# Altium project aptomat.PrjPCB
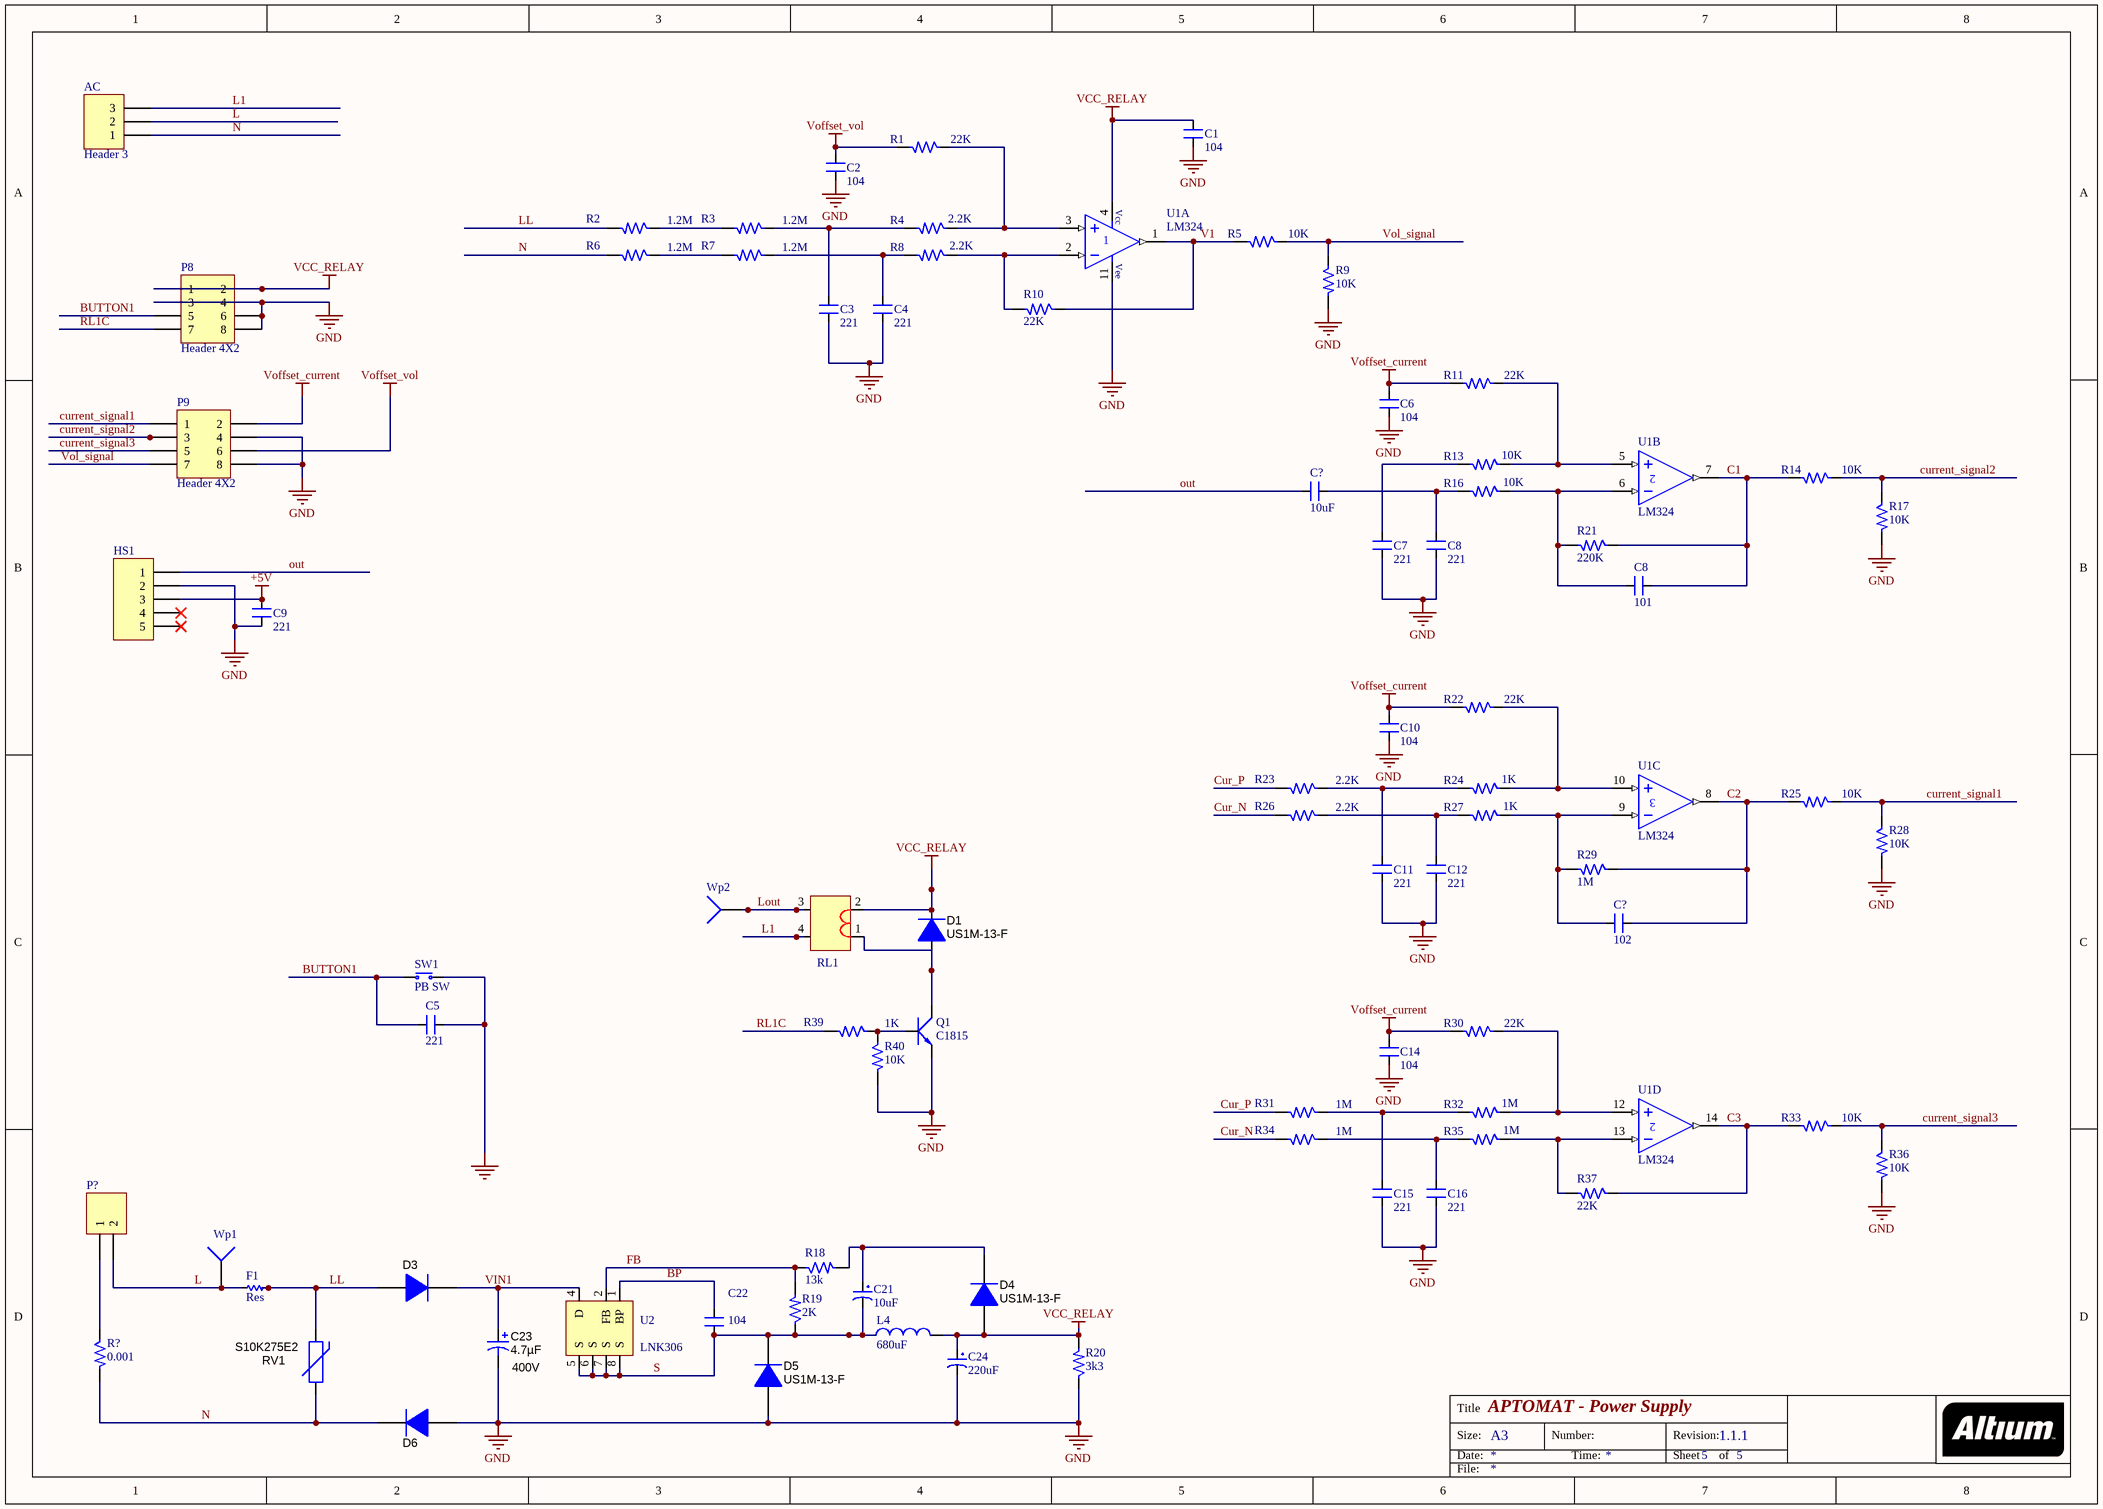
[diagram p0: Aptomat_power_supply.SchDoc]
1 sheet, 80 parts. Net scope: global (net labels, ports and power ports of the same name join across sheets).
Board file: Aptomat_Power.PcbDoc

## Sheet Aptomat_power_supply.SchDoc: APTOMAT - Power Supply
size A3; Revision: 1.1.1; SheetNumber: 5; SheetTotal: 5; DrawnBy: KJP; ProjectNumber: 4397; PCBRevision: 0071KJP; DocumentSize: A4; PCAName: PCA10040; PCBNumber: 400150; ProjectName: Quark

### Parts
(Parts that share a designator on the sheet are numbered #1, #2 ... from top to bottom, then left to right.)
AC  Header 3  [CHAN3DONG]
C1  104  [0805_HV]
C2  104  [0805_HV]
C3  221  [0805_HV]
C4  221  [0805_HV]
C5  221  [0805_HV]
C6  104  [0805_HV]
C7  221  [0805_HV]
C8#1  221  [0805_HV]
C8#2  101  [0805_HV]
C9  221  [0805_HV]
C10  104  [0805_HV]
C11  221  [0805_HV]
C12  221  [0805_HV]
C14  104  [0805_HV]
C15  221  [0805_HV]
C16  221  [0805_HV]
C21  10uF  [TU_NHOM_10uF_MH]
C22  104  [0805_HV]
C23  ValueDisplayed: 4.7µF  Value2: 400V  [PANACAP-G-GENERIC]  (hidden comment: 400AX6R8M8x11)
C24  220uF  [TU_NHOM_2.5_MH]
C?#1  10uF  [0805_HV]
C?#2  102  [0805_HV]
D1  US1M-13-F  [SMB]
D3  US1M-13-F  [SMB]  (value not drawn)
D4  US1M-13-F  [SMB]
D5  US1M-13-F  [SMB]
D6  US1M-13-F  [SMB]  (value not drawn)
F1  Res  [1206]
HS1  Header 5  [HDR1X5]  (value not drawn)
L4  680uF  [Inductor 4.5x5]
P8  Header 4X2  [HDR2X4]
P9  Header 4X2  [HDR2X4]
P?  Header 2  [HDR1X2]  (value not drawn)
Q1  C1815  [SOT23B]
R1  22K  [0805_HV]
R2  1.2M  [1206]
R3  1.2M  [1206]
R4  2.2K  [0805_HV]
R5  10K  [0805_HV]
R6  1.2M  [1206]
R7  1.2M  [1206]
R8  2.2K  [0805_HV]
R9  10K  [0805_HV]
R10  22K  [0805_HV]
R11  22K  [0805_HV]
R13  10K  [0805_HV]
R14  10K  [0805_HV]
R16  10K  [0805_HV]
R17  10K  [0805_HV]
R18  13k  [0805_HV]
R19  2K  [0805_HV]
R20  3k3  [0805_HV]
R21  220K  [0805_HV]
R22  22K  [0805_HV]
R23  2.2K  [0805_HV]
R24  1K  [0805_HV]
R25  10K  [0805_HV]
R26  2.2K  [0805_HV]
R27  1K  [0805_HV]
R28  10K  [0805_HV]
R29  1M  [0805_HV]
R30  22K  [0805_HV]
R31  1M  [0805_HV]
R32  1M  [0805_HV]
R33  10K  [0805_HV]
R34  1M  [0805_HV]
R35  1M  [0805_HV]
R36  10K  [0805_HV]
R37  22K  [0805_HV]
R39  1K  [0805_HV]
R40  10K  [0805_HV]
R?  0.001  [0805_HV]
RL1  Component_1  [RELAY30ASLA12VDC]  (value not drawn)
RV1  S10K275E2  [VAR_S10K275E2]
SW1  PB SW  [Switch-PB-6.2x6.3mm-SMD]
U1  LM324  [D014_L]  (parts A,B,C,D of 4)
U2  LNK306  [SOP 7]
Wp1  Socket  [PIN1]  (value not drawn)
Wp2  Socket  [PIN1]  (value not drawn)

### Nets
+5V: C9.2 HS1.3
GND: C1.1 C2.1 C3.1 C4.1 C5.1 C6.1 C7.1 C8#1.1 C9.1 C10.1 C11.1 C12.1 C14.1 C15.1 C16.1 C23.2(-) C24.2 D5.2(A) D6.2(A) HS1.2 P8.3 P8.4 P8.6 P8.8 P9.4 P9.8 Q1.3(E) R9.2 R17.2 R20.1 R28.2 R36.2 R40.2 SW1.1(N.O) U1.11(V-)
VCC_RELAY: C1.2 C24.1 D1.1(K) D4.2(A) L4.2 P8.1 P8.2 R20.2 RL1.2 U1.4(V+)
Voffset_current: C6.2 C10.2 C14.2 P9.2 R11.2 R22.2 R30.2
Voffset_vol: C2.2 P9.6 R1.2
BP: C22.2 U2.1(BP)
BUTTON1: C5.2 P8.5 SW1.2(COM)
C1: C8#2.1 R14.2 R21.1 U1.7(OUT)
C2: C?#2.1 R25.2 R29.1 U1.8(OUT)
C3: R33.2 R37.1 U1.14(OUT)
Cur_N: R26.2 R34.2
Cur_P: R23.2 R31.2
current_signal1: P9.1 R25.1 R28.1
current_signal2: P9.3 R14.1 R17.1
current_signal3: P9.5 R33.1 R36.1
FB: R18.1 R19.2 U2.2(FB)
L: AC.2 F1.2 P?.2 Wp1.1
L1: AC.3 RL1.4
LL: D3.2(A) F1.1 R2.2 RV1.2
Lout: RL1.3 Wp2.1
N: AC.1 D6.1(K) R6.2 R?.2 RV1.1
out: C?#1.2 HS1.1
RL1C: P8.7 R39.2
S: C21.2 C22.1 D5.1(K) L4.1 R19.1 U2.5(S) U2.6(S) U2.7(S) U2.8(S)
V1: R5.2 R10.1 U1.1(OUT)
VIN1: C23.1(+) D3.1(K) U2.4(D)
Vol_signal: P9.7 R5.1 R9.1
NetC3_2: C3.2 R3.1 R4.2
NetC4_2: C4.2 R7.1 R8.2
NetC7_2: C7.2 R13.2
NetC8#1_2: C8#1.2 C?#1.1 R16.2
NetC8#2_2: C8#2.2 R16.1 R21.2 U1.6(IN-)
NetC11_2: C11.2 R23.1 R24.2
NetC12_2: C12.2 R26.1 R27.2
NetC15_2: C15.2 R31.1 R32.2
NetC16_2: C16.2 R34.1 R35.2
NetC21_1: C21.1 D4.1(K) R18.2
NetC?#2_2: C?#2.2 R27.1 R29.2 U1.9(IN-)
NetD1_2: D1.2(A) Q1.2(C) RL1.1
NetP?_1: P?.1 R?.1
NetQ1_1: Q1.1(B) R39.1 R40.1
NetR1_1: R1.1 R4.1 U1.3(IN+)
NetR2_1: R2.1 R3.2
NetR6_1: R6.1 R7.2
NetR8_1: R8.1 R10.2 U1.2(IN-)
NetR11_1: R11.1 R13.1 U1.5(IN+)
NetR22_1: R22.1 R24.1 U1.10(IN+)
NetR30_1: R30.1 R32.1 U1.12(IN+)
NetR35_1: R35.1 R37.2 U1.13(IN-)

Not connected (* = marked no-connect by the designer): HS1 4* 5*

### Notes on the sheet
- Title
- Size:
- Date:
- A3
- Number:
- Time:
- Revision:
- Sheet
- of
- File:
- (in symbol LM324_MH, part A) Vcc; Vee

### Library data of the parts
AC = Header 3: Header, 3-Pin; LatestRevisionDate: 17-Jul-2002; LatestRevisionNote: Re-released for DXP Platform.; Publisher: Altium Limited
C1-C7 C8#1 C8#2 C9-C12 C14-C16 C22 C?#1 C?#2 = CM: Cap SMD; Value: 103
C21 = TU_NHOM_10uF_25V_MH: Value: 47uF/16 - 50V; Description 1: 470uF/6,3V - 330uF/10V - 220uF/16V; Description 2: 100uF/25V - 35V - 47uF/50V - 22uF/100V; Description 3: 33uF => 47uF/63V - 1uF => 4,7uF/160V; Description 4: 1uF => 2,2uF/250V - 1uF/350V
C23 = 400AX6R8M8x11: CAP, AL, 6.8uF, 400V, +/-20%, TH; Manufacturer: Rubycon; Polarized: Y; CompType: Capacitor; U/M: EA; Cap_F: 0.0000068; Tolerance_%: 20; Value1: Unknown; VDC_V: 400; TaMin_C: -40; TaMax_C: 105; Cap_Case: 8x11; SymbolVersion: 2008-07-09; Value: 6.8uF; PartNumber: 400AX6R8M8x11; PackageReference: 8x11; RoHS: Y; MountType: TH; Technology: AL; Series: AX; Publisher: Texas Instruments; LatestRevisionDate: 2013-08-02; ComponentLink1Description: Datasheet link; ComponentLink1URL: http://www.rubycon.co.jp/de/catalog/e_pdfs/aluminum/e_ax.pdf
C24 = TU_NHOM_220uF_25V_MH: LINK: https://item.taobao.com/item.htm?spm=a230r.1.14.282.6c612953FsebRk&id=546158429968&ns=1&abbucket=10#detail
D1 D3-D6 = MURS160-13-F: Diode, Ultrafast, 600V, 1A, SMB; Manufacturer: Diodes Inc.; U/M: EA; Vf_V: 1.25; Value2: 1.25V; Io_A: 1; Vr_V: 600; TJmax_C: 150; RJC_CperW: 13; PartNumber: US1M-13-F; CompType: Diode; SymbolVersion: 2008-12-08; MountType: SMT; RoHS: Y; Value: 600V; PackageReference: SMB; Value1: 1A; Type: Ultrafast; Published: 2008-06-26; Publisher: Texas Instruments; LatestRevisionDate: 2013-06-21; ComponentLink1Description: Datasheet link; ComponentLink1URL: http://www.diodes.com/datasheets/ds30130.pdf; Supplier 1: Digi-Key; Supplier 2: Mouser; Supplier 3: Farnell
F1 = Res-SMD: Resistor; Manufacturer: Generic Components; Class: Passive; Published: 08/06/2000; Publisher: Altium Hobart Technology Centre
HS1 = Header 5: Header, 5-Pin; LatestRevisionDate: 17-Jul-2002; LatestRevisionNote: Re-released for DXP Platform.; Publisher: Altium Limited
L4 = Inductor 4.5x5_MH
P8 P9 = Header 4X2: Header, 4-Pin, Dual row; LatestRevisionDate: 17-Jul-2002; LatestRevisionNote: Re-released for DXP Platform.; Publisher: Altium Limited
P? = Header 2: Header, 2-Pin; LatestRevisionDate: 17-Jul-2002; LatestRevisionNote: Re-released for DXP Platform.; Publisher: Altium Limited
Q1 = C1815: NPN 600mW, ECB; Value: C1815
R1-R11 R13 R14 R16-R37 R39 R40 R? = R: Resistor 1/4W; Value: R1/4W - 1K
RV1 = S10K275E2: Varistor 275V RMS 10MM Radial, TH; Manufacturer: EPCOS Inc; SymbolCreator: a0412235; SymbolVersion: 2012-06-04; PartNumber: S10K275E2; MountType: TH; ComponentLink1Description: Datasheet URL; ComponentLink1URL: http://www.epcos.com/inf/70/db/var_08/SIOV_Leaded_AdvanceD.pdf; RoHS: Y; PackageReference: 10mm Radial; Publisher: Texas Instruments; LatestRevisionDate: 2013-02-24; Supplier 1: Digi-Key; Supplier Part Number 1: 495-1433-ND
SW1 = Switch-PB-6.2x6.3mm-SMD: Tactile Switch, SPNO, SMD, 160gf, 6.2x6.3x2.5mm; Manufacturer: Dailywell; Manufacturer Part Number: TS604VM1-025BR-R; 2nd source part number: 688-SKHUALE010; Artikkelnr Noca: 50019106; Artikkelnr Simpro: N.A.; Part Number: Switch-PB-6.2x6.3mm-SMD; Datasheet: \\hizz\pro\app9717\Datasheet\switches\Daliywell\TS604VM1-025BR-R.pdf; Footprint Doc: Switch-PB-6.2x6.3mm-SMD; LatestRevisionDate: 2016-04-21; Pin Count: 4; Publisher: Nordic Semiconductor; Published: 2010-02-01; Value: PB SW; Note: *; Supplier: Cabcon; Supplier part number: TS604VM1-025BR-R; 2nd source Supplier: Mouser
U1 = LM324_MH: Op x 4; Value: LM324
U2 = Component_1
Wp1 Wp2 = Socket: LatestRevisionDate: 17-Jul-2002; LatestRevisionNote: Re-released for DXP Platform.; Publisher: Altium Limited